# Altium schematic sheet cs301_template.SchDoc
size A4
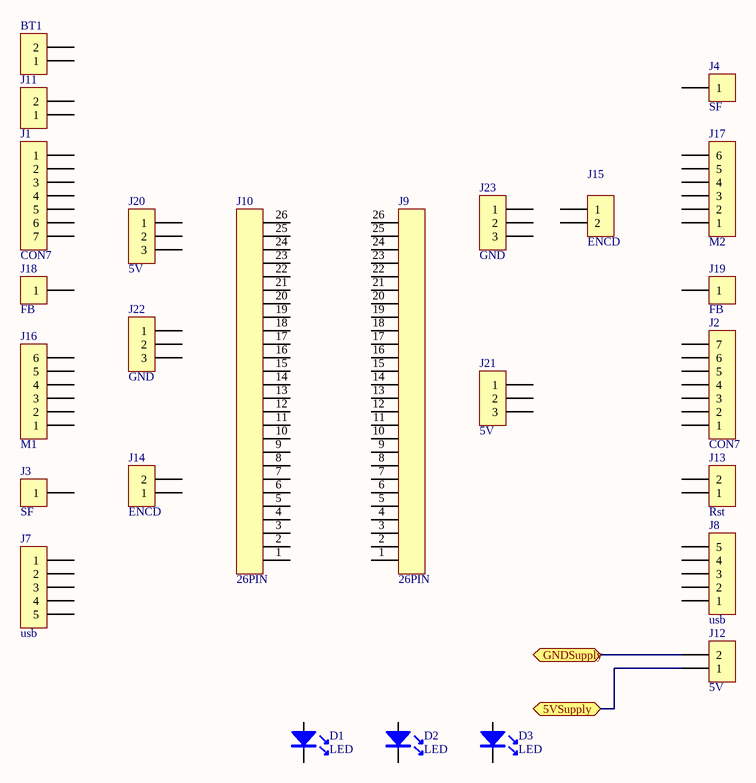
[diagram p0: cs301_template.SchDoc]

## Parts
BT1  Battery  [sip2]  (value not drawn)
D1  LED  [LED0.1/5MM]
D2  LED  [LED0.1/5MM]
D3  LED  [LED0.1/5MM]
J1  CON7  [SIP7]
J2  CON7  [SIP7]
J3  SF  [SIP1/0.6]
J4  SF  [SIP1/0.6]
J7  usb  [SIP5]
J8  usb  [SIP5]
J9  26PIN  [SIP26]
J10  26PIN  [SIP26]
J11  Battery  [sip2]  (value not drawn)
J12  5V  [sip2]
J13  Rst  [sip2]
J14  ENCD  [sip2]
J15  ENCD  [sip2]
J16  M1  [sip6]
J17  M2  [sip6]
J18  FB  [SIP1/0.6]
J19  FB  [SIP1/0.6]
J20  5V  [sip3]
J21  5V  [sip3]
J22  GND  [sip3]
J23  GND  [sip3]

## Ports
5VSupply, GNDSupply

## Nets
5VSupply: J12.1 ; port 5VSupply
GNDSupply: J12.2 ; port GNDSupply

Not connected (* = marked no-connect by the designer): BT1 1 2; D1 A(1) K(2); D2 A(1) K(2); D3 A(1) K(2); J1 1 2 3 4 5 6 7; J2 1 2 3 4 5 6 7; J3 1; J4 1; J7 1 2 3 4 5; J8 1 2 3 4 5; J9 1 2 3 4 5 6 7 8 9 10 11 12 13 14 15 16 17 18 19 20 21 22 23 24 25 26; J10 1 2 3 4 5 6 7 8 9 10 11 12 13 14 15 16 17 18 19 20 21 22 23 24 25 26; J11 1 2; J13 1 2; J14 1 2; J15 1 2; J16 1 2 3 4 5 6; J17 1 2 3 4 5 6; J18 1; J19 1; J20 1 2 3; J21 1 2 3; J22 1 2 3; J23 1 2 3

## Library data of the parts
BT1 J11-J15 = CON2: Connector
J1 J2 = CON7: Connector
J3 J4 J18 J19 = CON1: Connector
J7 J8 = CON5: Connector
J16 J17 = CON6: Connector
J20-J23 = CON3: Connector